# EAGLE design PIRT1280A1-12-breakout (EAGLE 9.6.2)
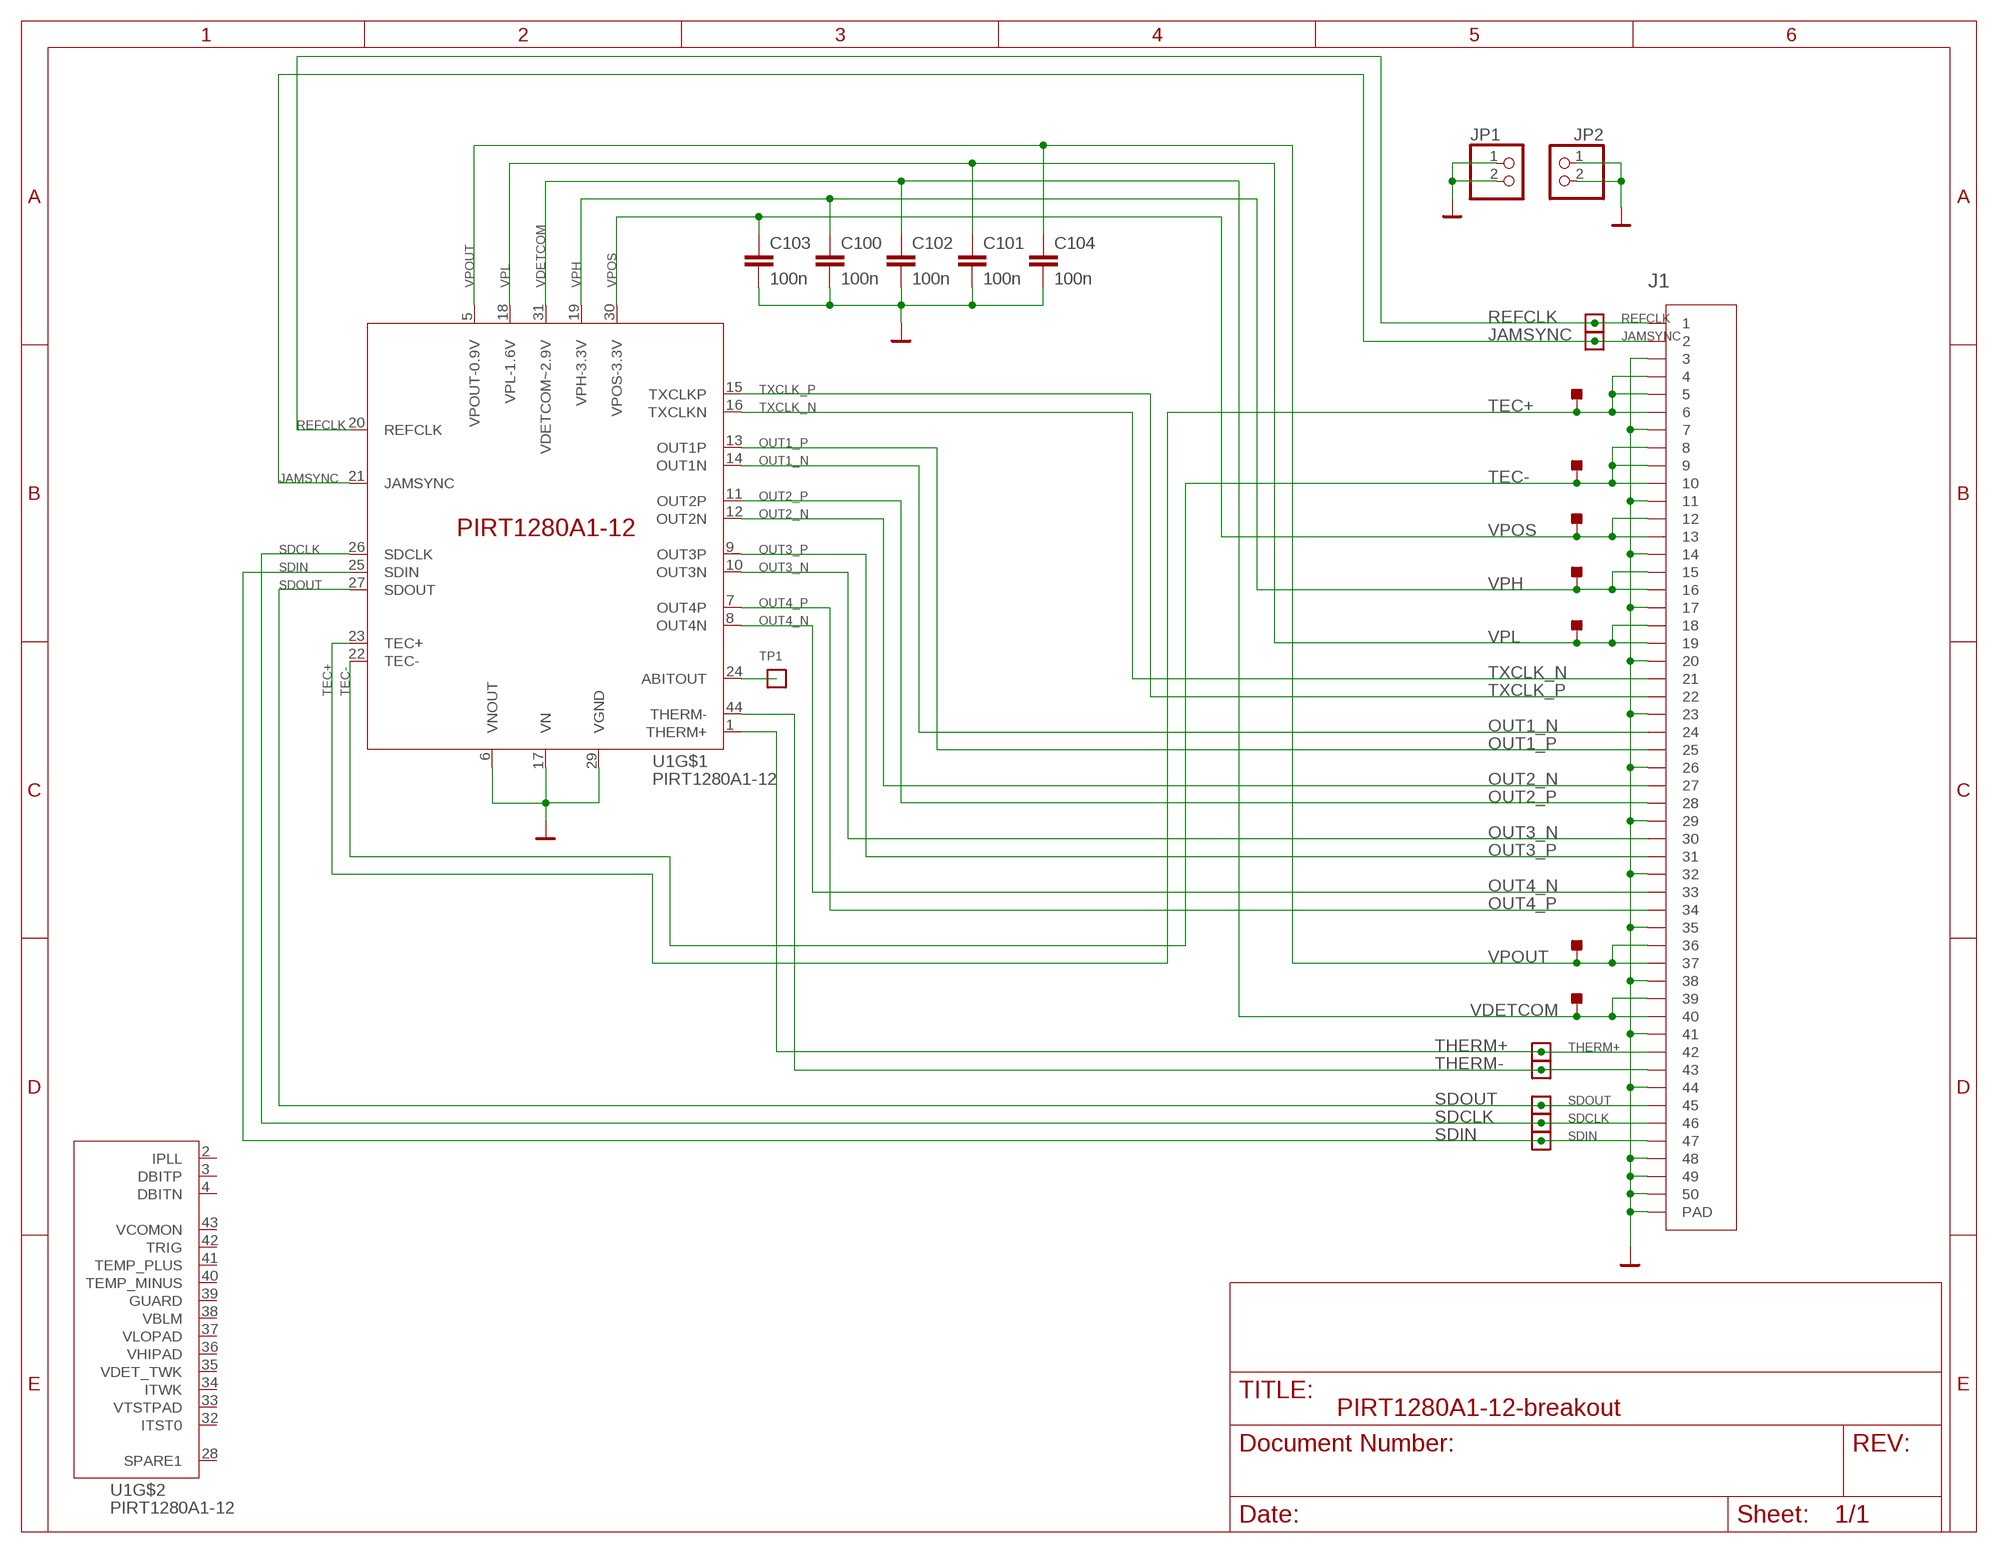
[diagram p0: schematic, sheet 1]

## Parts
C100  100n  C-EU0805-A  [.0805-A]
C101  100n  C-EU0805-A  [.0805-A]
C102  100n  C-EU0805-A  [.0805-A]
C103  100n  C-EU0805-A  [.0805-A]
C104  100n  C-EU0805-A  [.0805-A]
J1  5-1734592-0  [TE_5-1734592-0]
JAMSYNC  TEST-POINT-LARGE-SQUARE  [1X01]
JP1  PINHD-1X2  [1X02]
JP2  PINHD-1X2  [1X02]
REFCLK  TEST-POINT-LARGE-SQUARE  [1X01]
SDCLK  TEST-POINT-LARGE-SQUARE  [1X01]
SDIN  TEST-POINT-LARGE-SQUARE  [1X01]
SDOUT  TEST-POINT-LARGE-SQUARE  [1X01]
TEC+  TEST-POINT_SMD-SMD-10SN  [TESTPOINT_SMD-10SN]
TEC-  TEST-POINT_SMD-SMD-10SN  [TESTPOINT_SMD-10SN]
THERM+  TEST-POINT-LARGE-SQUARE  [1X01]
THERM-  TEST-POINT-LARGE-SQUARE  [1X01]
TP1  TEST-POINT-LARGE-SQUARE  [1X01]
U1  PIRT1280A1-12  [PIRT1280A1-12]
VDETCOM  TEST-POINT_SMD-SMD-10SN  [TESTPOINT_SMD-10SN]
VPH  TEST-POINT_SMD-SMD-10SN  [TESTPOINT_SMD-10SN]
VPL  TEST-POINT_SMD-SMD-10SN  [TESTPOINT_SMD-10SN]
VPOS  TEST-POINT_SMD-SMD-10SN  [TESTPOINT_SMD-10SN]
VPOUT  TEST-POINT_SMD-SMD-10SN  [TESTPOINT_SMD-10SN]

## Nets
ABITOUT: TP1.1 U1.24(ABITOUT)
GND: C100.2 C101.2 C102.2 C103.2 C104.2 J1.3 J1.7 J1.11 J1.14 J1.17 J1.20 J1.23 J1.26 J1.29 J1.32 J1.35 J1.38 J1.41 J1.44 J1.48 J1.49 J1.50 J1.S1(PAD) J1.S2(PAD) JP1.1 JP1.2 JP2.1 JP2.2 U1.6(VNOUT) U1.17(VN) U1.29(VGND)
JAMSYNC: J1.2 JAMSYNC.1 U1.21(JAMSYNC)
OUT1_N [diff-pair]: J1.24 U1.14(OUT1N)
OUT1_P [diff-pair]: J1.25 U1.13(OUT1P)
OUT2_N [diff-pair]: J1.27 U1.12(OUT2N)
OUT2_P [diff-pair]: J1.28 U1.11(OUT2P)
OUT3_N [diff-pair]: J1.30 U1.10(OUT3N)
OUT3_P [diff-pair]: J1.31 U1.9(OUT3P)
OUT4_N [diff-pair]: J1.33 U1.8(OUT4N)
OUT4_P [diff-pair]: J1.34 U1.7(OUT4P)
REFCLK: J1.1 REFCLK.1 U1.20(REFCLK)
SDCLK: J1.46 SDCLK.1 U1.26(SDCLK)
SDIN: J1.47 SDIN.1 U1.25(SDIN)
SDOUT: J1.45 SDOUT.1 U1.27(SDOUT)
TEC+: J1.4 J1.5 J1.6 TEC+.TP U1.23(TEC+)
TEC-: J1.8 J1.9 J1.10 TEC-.TP U1.22(TEC-)
THERM+: J1.42 THERM+.1 U1.1(THERM+)
THERM-: J1.43 THERM-.1 U1.44(THERM-)
TXCLK_N [diff-pair]: J1.21 U1.16(TXCLKN)
TXCLK_P [diff-pair]: J1.22 U1.15(TXCLKP)
VDETCOM: C102.1 J1.39 J1.40 U1.31(VDETCOM~2.9V) VDETCOM.TP
VPH: C100.1 J1.15 J1.16 U1.19(VPH-3.3V) VPH.TP
VPL: C101.1 J1.18 J1.19 U1.18(VPL-1.6V) VPL.TP
VPOS: C103.1 J1.12 J1.13 U1.30(VPOS-3.3V) VPOS.TP
VPOUT: C104.1 J1.36 J1.37 U1.5(VPOUT-0.9V) VPOUT.TP
Unconnected: U1.2(IPLL) U1.3(DBITP) U1.4(DBITN) U1.28(SPARE1) U1.32(ITST0) U1.33(VTSTPAD) U1.34(ITWK) U1.35(VDET_TWK) U1.36(VHIPAD) U1.37(VLOPAD) U1.38(VBLM) U1.39(GUARD) U1.40(TEMP_MINUS) U1.41(TEMP_PLUS) U1.42(TRIG) U1.43(VCOMON)

## Library data of the parts
C100-C104 = oresat-rcl:C-EU: CAPACITOR, European symbol
J1 = J-TEConnectivity-X-1734592-X:5-1734592-0
JAMSYNC REFCLK SDCLK SDIN SDOUT THERM+ THERM- TP1 = oresat-misc:TEST-POINT-LARGE-SQUARE
JP1 JP2 = pinhead:PINHD-1X2: PIN HEADER
TEC+ TEC- VDETCOM VPH VPL VPOS VPOUT = oresat-misc:TEST-POINT_SMD: TEST POINT PAD; BOM: EXCLUDE
U1 = PIRT1280A1-12:PIRT1280A1-12: Footprint for the Princeton PIRT1280A1-12 SWIR Sensor

## Net classes
1 diff-pair: width 0.381 mm, clearance 0.508 mm to class 0, clearance 0.254 mm

## Board
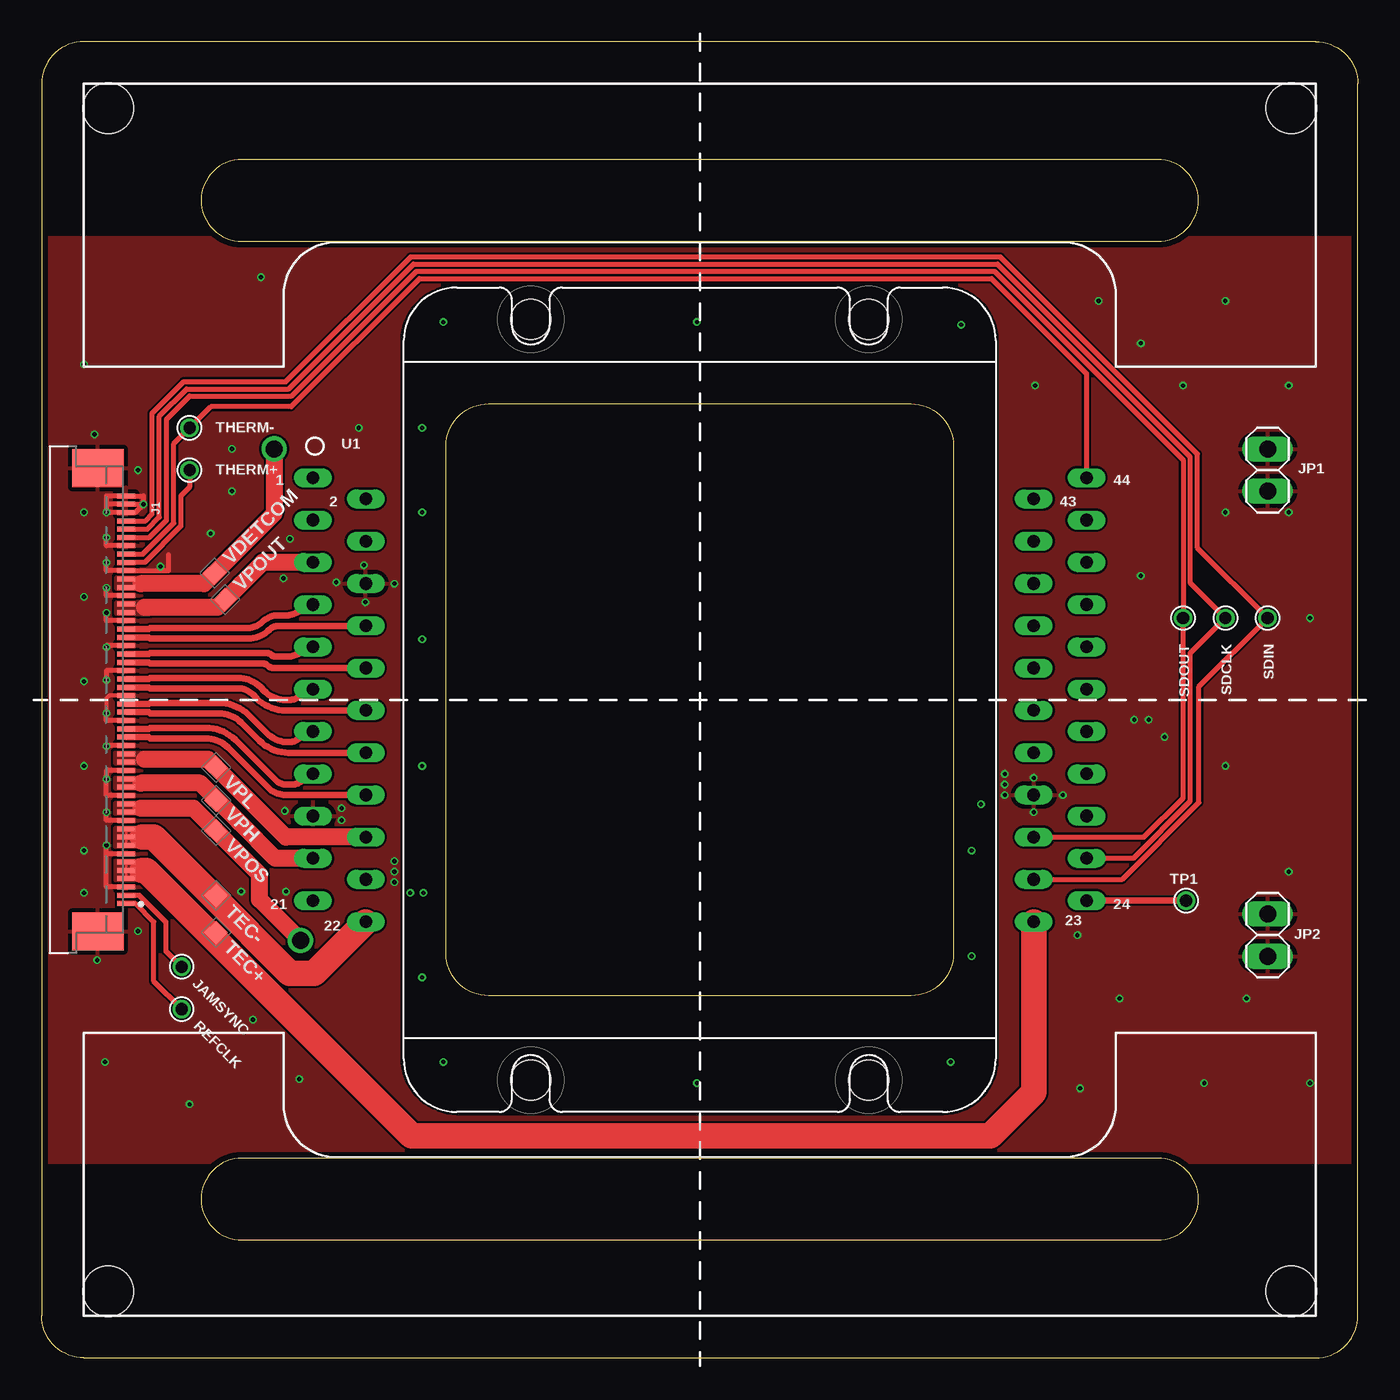
[diagram p1: board, top side]
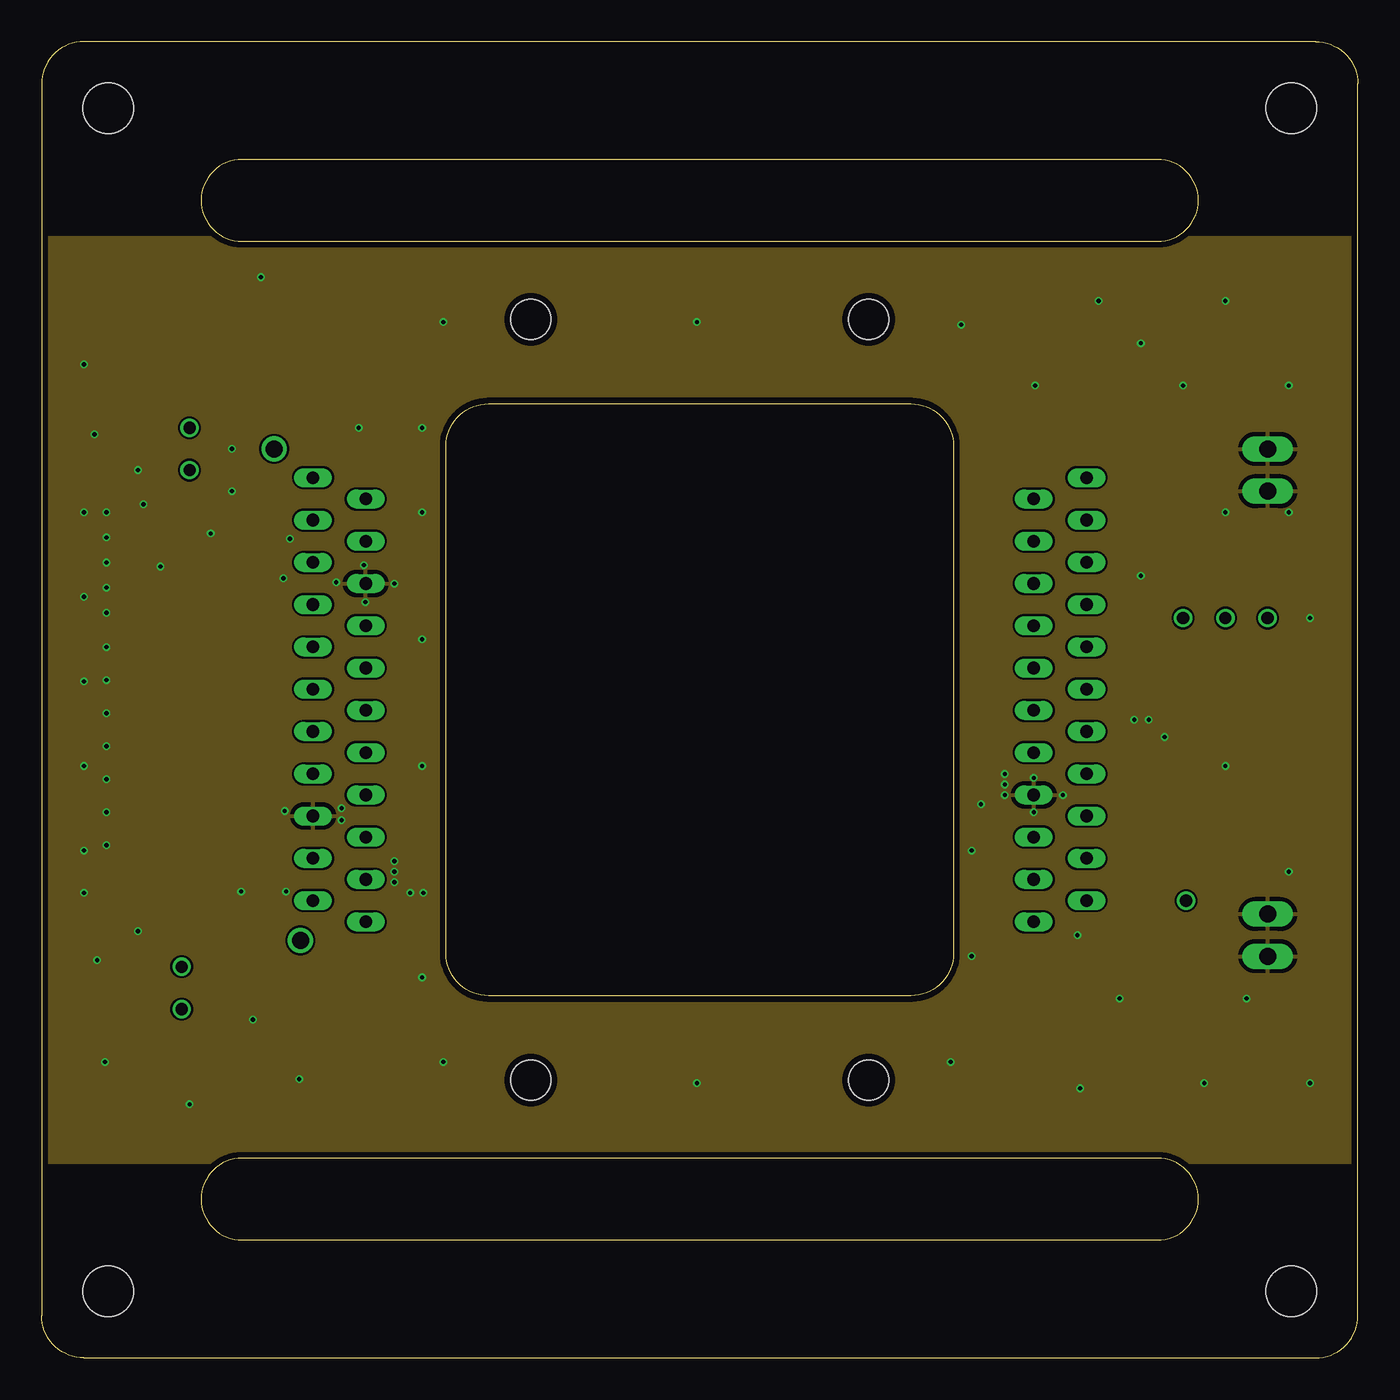
[diagram p2: board, inner layer Route2]
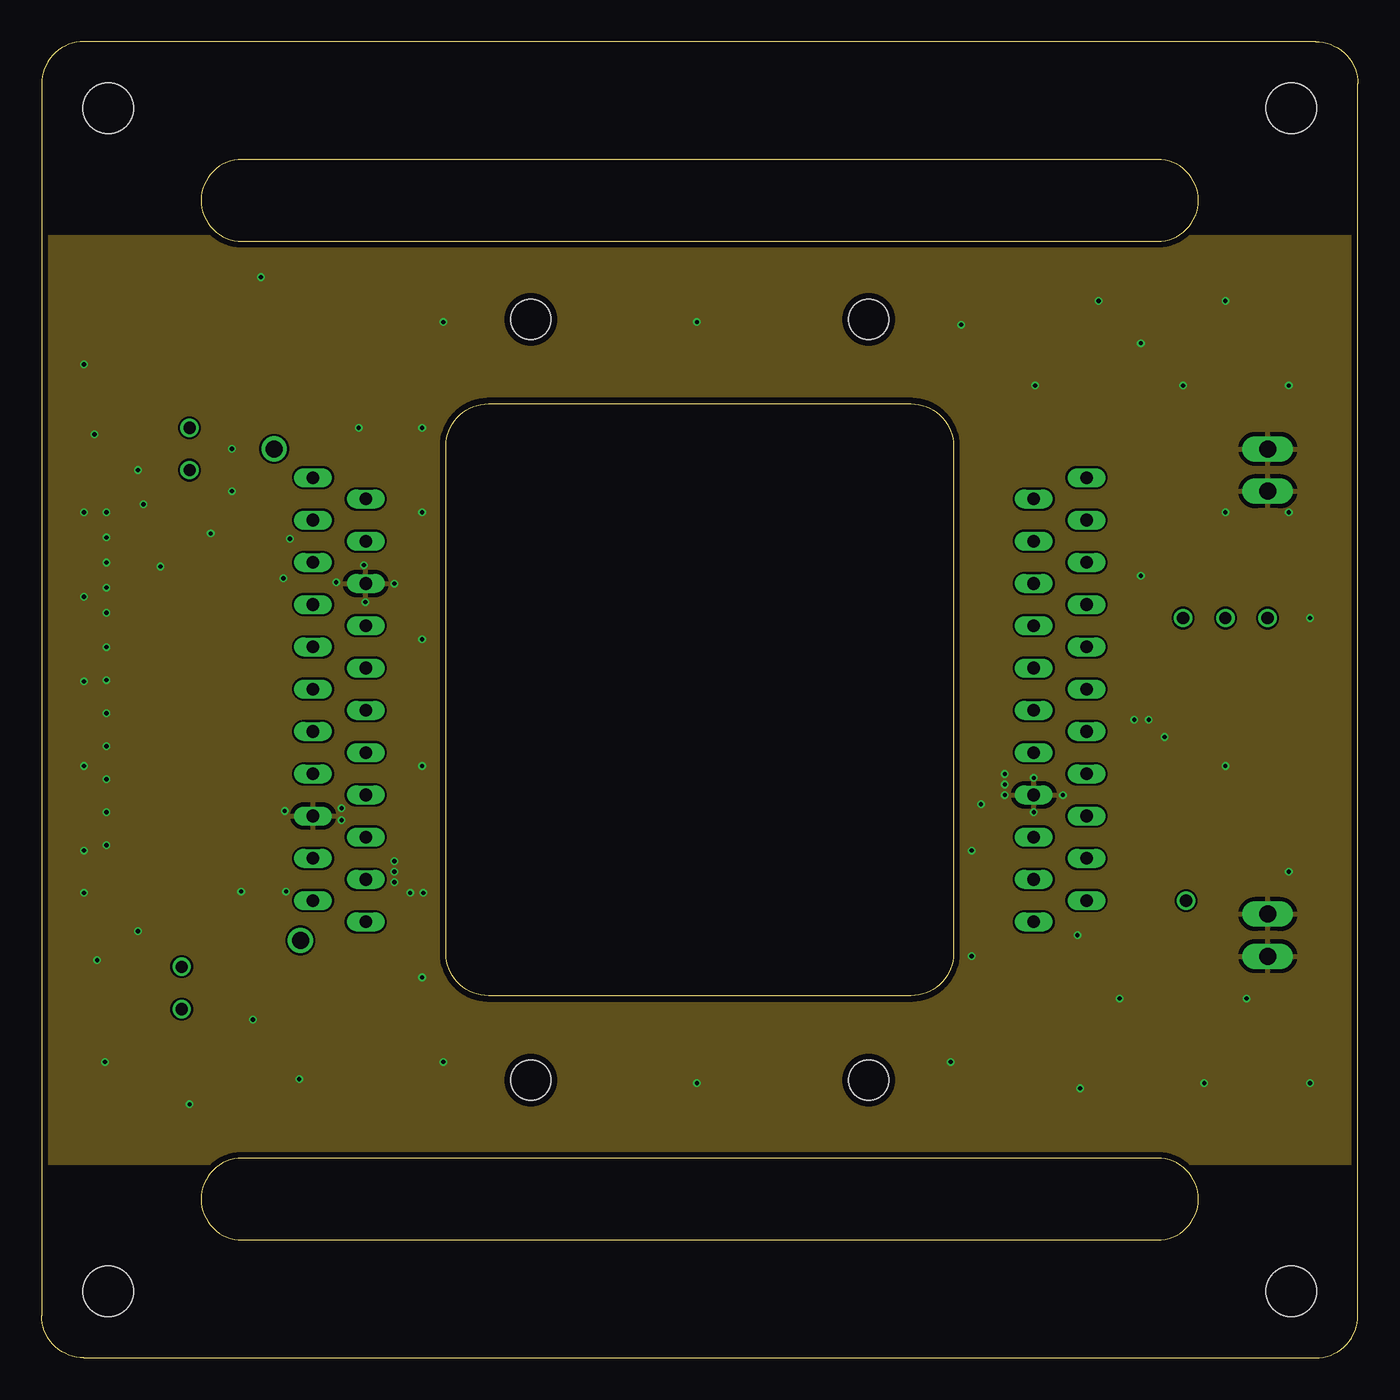
[diagram p3: board, inner layer Route15]
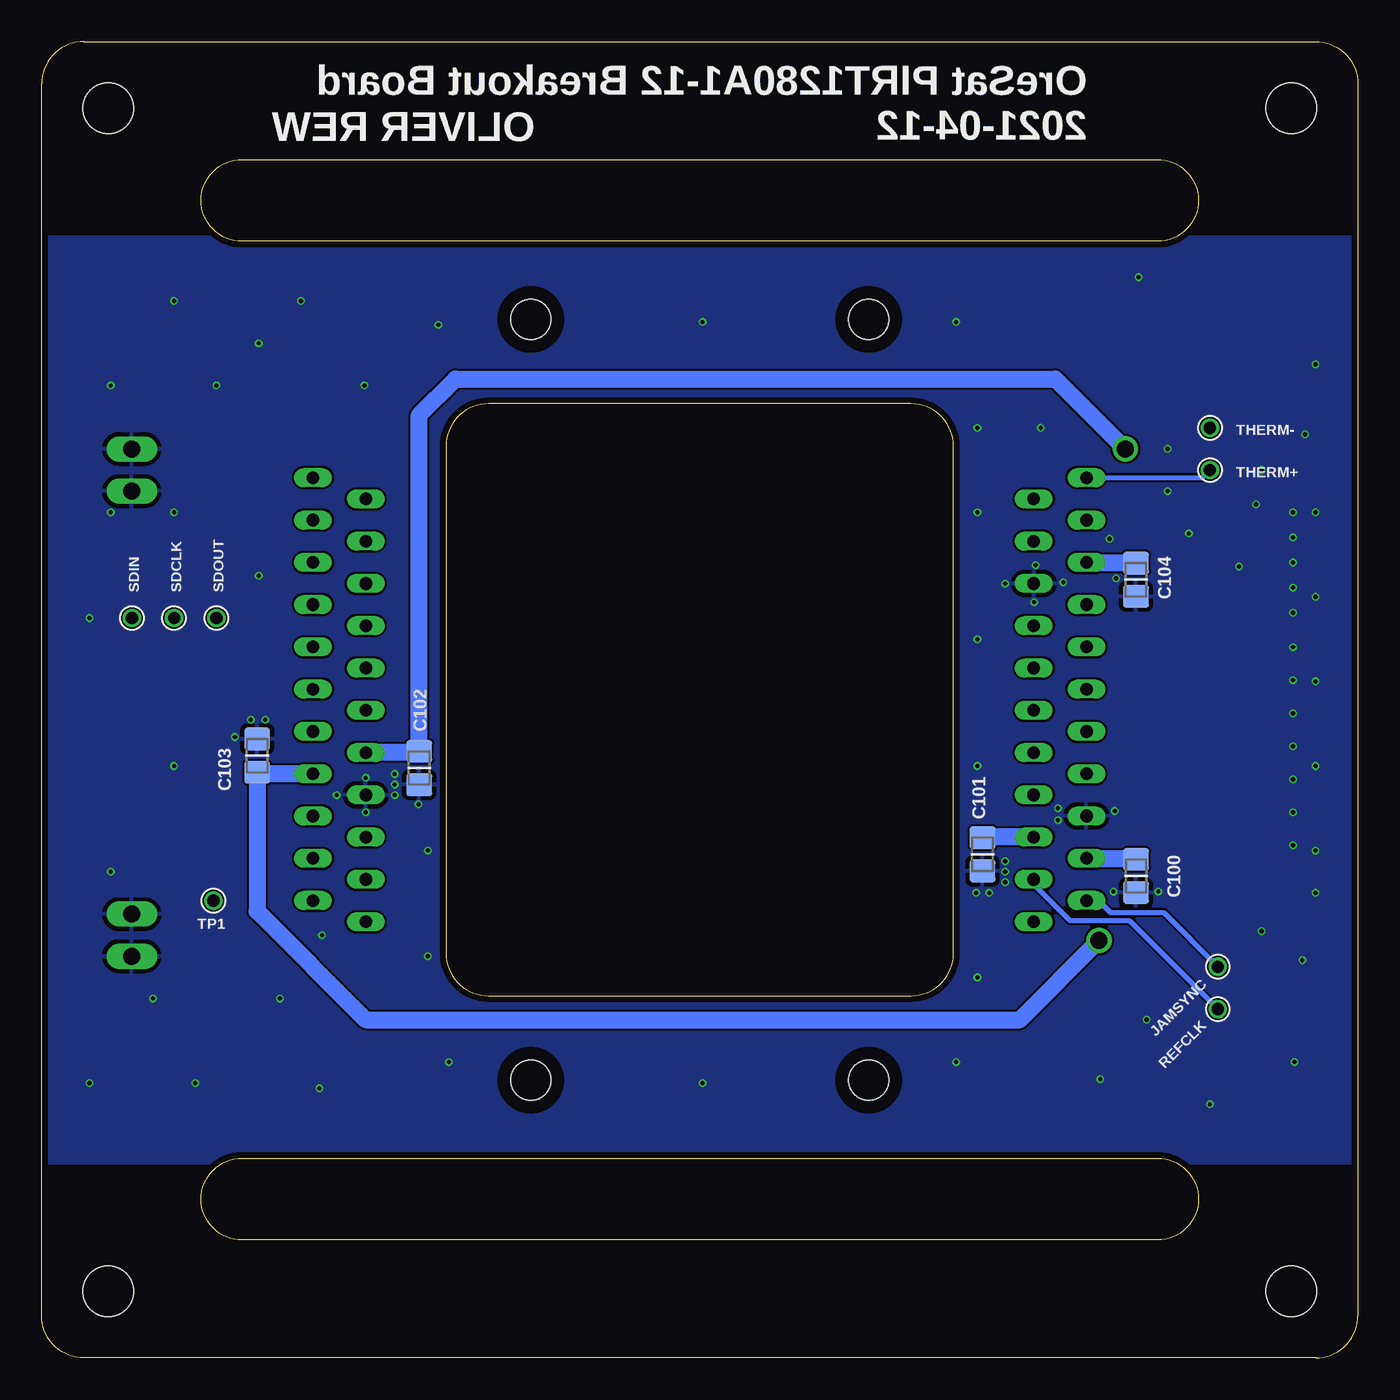
[diagram p4: board, bottom side, seen from below]

Size 79.08 x 79.08 mm. Coordinates in mm from the lower left corner, seen from the top.
Outline: 2.54,0 76.54,0 arc90 79.08,2.54 79.08,76.54 arc90 76.54,79.08 2.54,79.08 arc90 0,76.54 0,2.54 arc90 2.54,0
Outline: 12.04,72 arc180 12.04,67.08 67.04,67.08 arc180 67.04,72 12.04,72
Outline: 12.04,12 arc180 12.04,7.08 67.04,7.08 arc180 67.04,12 12.04,12
Copper layers (1*2*15*16): Top 0.035559375mm / dielectric 0.17018125mm / Route2 0.01778125mm / dielectric 47mil / Route15 0.01778125mm / dielectric 0.17018125mm / Bottom 0.035559375mm
Design rules "oshpark-4layer-tented": minimum track width 5mil, minimum drill 10mil, track to track 5mil, track to pad 5mil, pad to pad 5mil, via to via 5mil, smd to smd 5mil, copper to edge 15mil, drill to drill 6mil, minimum pad ring 4mil, minimum via ring 4mil, stop-mask expansion 2.5mil, vias tented up to drill 20mil, thermal gap 10mil
Holes 3 mm at 4,75.08 75.08,75.08 4,4 75.08,4
tRestrict: area 21.7,14.8 to 57.3,64.3

### Footprints (pad centres in the part's own frame; a part is rotated, then mirrored left to right if it is on the bottom)
.0805-A = smd 1.35 x 1.55: 1 -1,0; 2 1,0
TE_5-1734592-0 = smd 0.3 x 1.1: 1 -12.25,0; 2 -11.75,0; 3 -11.25,0; 4 -10.75,0; 5 -10.25,0; 6 -9.75,0; 7 -9.25,0; 8 -8.75,0; 9 -8.25,0; 10 -7.75,0; 11 -7.25,0; 12 -6.75,0; 13 -6.25,0; 14 -5.75,0; 15 -5.25,0; 16 -4.75,0; 17 -4.25,0; 18 -3.75,0; 19 -3.25,0; 20 -2.75,0; 21 -2.25,0; 22 -1.75,0; 23 -1.25,0; 24 -0.75,0; 25 -0.25,0; 26 0.25,0; 27 0.75,0; 28 1.25,0; 29 1.75,0; 30 2.25,0; 31 2.75,0; 32 3.25,0; 33 3.75,0; 34 4.25,0; 35 4.75,0; 36 5.25,0; 37 5.75,0; 38 6.25,0; 39 6.75,0; 40 7.25,0; 41 7.75,0; 42 8.25,0; 43 8.75,0; 44 9.25,0; 45 9.75,0; 46 10.25,0; 47 10.75,0; 48 11.25,0; 49 11.75,0; 50 12.25,0 | smd 2.3 x 3.1: S1 13.92,1.7; S2 -13.92,1.7
1X01 = drill 0.737 pad 1.1: 1 0,0
1X02 = drill 1.016 long: 1 -1.27,0; 2 1.27,0
TESTPOINT_SMD-10SN = smd 1 x 1: TP 0,0
PIRT1280A1-12 = drill 0.762 long: 1 -23.241,13.335; 2 -20.066,12.065; 3 -23.241,10.795; 4 -20.066,9.525; 5 -23.241,8.255; 6 -20.066,6.985; 7 -23.241,5.715; 8 -20.066,4.445; 9 -23.241,3.175; 10 -20.066,1.905; 11 -23.241,0.635; 12 -20.066,-0.635; 13 -23.241,-1.905; 14 -20.066,-3.175; 15 -23.241,-4.445; 16 -20.066,-5.715; 17 -23.241,-6.985; 18 -20.066,-8.255; 19 -23.241,-9.525; 20 -20.066,-10.795; 21 -23.241,-12.065; 22 -20.066,-13.335; 23 20.066,-13.335; 24 23.241,-12.065; 25 20.066,-10.795; 26 23.241,-9.525; 27 20.066,-8.255; 28 23.241,-6.985; 29 20.066,-5.715; 30 23.241,-4.445; 31 20.066,-3.175; 32 23.241,-1.905; 33 20.066,-0.635; 34 23.241,0.635; 35 20.066,1.905; 36 23.241,3.175; 37 20.066,4.445; 38 23.241,5.715; 39 20.066,6.985; 40 23.241,8.255; 41 20.066,9.525; 42 23.241,10.795; 43 20.066,12.065; 44 23.241,13.335 | hole 2.4: -10.16,22.86; 10.16,22.86; 10.16,-22.86; -10.16,-22.86

### Placement (x,y rotation side)
C100  13.33,28.96 270 bottom
C101  22.55,30.25 270 bottom
C102  56.39,35.44 270 bottom
C103  66.13,36.18 90 bottom
C104  13.34,46.75 270 bottom
J1  5.08,39.54 90 top
JAMSYNC  8.41,23.5 0 top
JP1  73.66,53.34 90 top
JP2  73.66,25.4 90 top
REFCLK  8.41,20.95 0 top
SDCLK  71.12,44.45 270 top
SDIN  73.66,44.45 270 top
SDOUT  68.58,44.45 270 top
TEC+  10.48,25.56 45 top
TEC-  10.48,27.78 45 top
THERM+  8.89,53.34 0 top
THERM-  8.89,55.88 0 top
TP1  68.75,27.48 0 top
U1  39.54,39.54 0 top
VDETCOM  10.4,47.15 45 top
VPH  10.48,33.5 45 top
VPL  10.48,35.48 45 top
VPOS  10.48,31.67 45 top
VPOUT  11.03,45.56 45 top

### Tracks (layer width: path | path; a pad name or v marks a point on that pad's centre or on a via)
ABITOUT
  Top 0.381: U1.24 TP1.1
GND  (via drill 0.25)
  Top 0.254: J1.26 4.07,39.79 3.89,39.61 v3.89,38.73
  Top 0.305: v3.89,47.78 3.89,47.29 J1.41 5.17,47.29 5.17,47.3 7.62,47.3 7.62,48.26 | J1.44 3.89,48.79 v3.89,49.29 | J1.38 3.89,45.79 v3.89,46.28 | J1.35 3.89,44.29 v3.89,44.77 | J1.32 3.89,42.79 v3.89,42.7 | J1.29 3.89,41.29 v3.89,40.72 | J1.23 3.89,38.29 v3.89,38.73 | J1.20 3.89,36.79 v3.89,36.75 | J1.17 3.89,35.29 v3.89,34.77 3.89,33.79 J1.14 | J1.11 3.89,32.29 v3.89,32.78 | J1.7 3.89,30.29 | 3.89,30.29 v3.89,30.8 | J1.3 3.89,28.29 3.89,30.29 | 3.89,51.29 J1.49 v6.11,51.29 v6.11,51.28 | 3.89,51.29 v3.89,50.8 v3.89,50.79 J1.48 5.63,50.79 v6.11,51.28 | 3.89,51.29 3.89,51.79 J1.50 6.11,51.79 v6.11,51.28
  other vias: 11.99,28.02 14.68,28.02 22.15,27.94 14.53,46.83 17.7,46.59 19.37,47.62 19.45,45.4 21.19,46.51 22.94,27.94 21.19,29.21 65.64,38.34 66.52,38.34 67.47,37.31 61.36,33.81 59.61,34.85 57.86,33.81 59.61,32.78 5.79,53.34 3.17,55.48 5.79,25.64 3.33,23.89 56.44,33.26 14.61,32.86 18.02,33.02 18.02,32.31 7.14,47.55 10.16,49.53 11.43,52.07 11.43,54.61 19.05,55.88 2.54,59.69 12.7,20.32 3.81,17.78 64.77,21.59 62.23,25.4 55.88,24.13 22.86,22.86 39.37,62.23 59.69,58.42 66.04,46.99 24.13,62.23 39.37,16.51 24.13,17.78 54.61,17.78 14.92,49.21 55.24,62.07 68.58,58.42 66.04,60.96 63.5,63.5 13.18,64.93 15.48,16.75 71.12,50.8 71.12,35.56 62.39,16.19 22.86,35.56 22.86,43.18 22.86,50.8 22.86,55.88 55.88,30.48 2.54,30.48 2.54,35.56 2.54,40.64 2.54,45.72 2.54,50.8 2.54,27.94 69.85,16.51 72.39,21.59 74.93,29.21 76.2,44.45 74.93,50.8 74.93,58.42 71.12,63.5 76.2,16.51 8.89,15.24 21.19,29.84 21.19,28.57 57.86,34.45 57.86,35.08
  pour Bottom (rank 2): -1.27,11.75 -1.27,67.31 80.01,67.31 80.01,11.75
  pour Top (rank 2): -2.54,11.75 -2.54,67.31 81.28,67.31 81.28,11.75
  pour Route2: -3.81,11.75 -3.81,67.31 82.55,67.31 82.55,11.75
  pour Route15: -5.08,11.75 83.82,11.75 83.82,67.31 -5.08,67.31
JAMSYNC
  Top 0.305: JAMSYNC.1 7.46,24.45 7.46,26.19 5.87,27.79 J1.2
  Bottom 0.305: U1.21 15.59,27.48 14.86,26.75 11.67,26.75 JAMSYNC.1
OUT1_N
  Top 0.381: J1.24 6.44,38.79 6.51,38.72 10.65,38.72 arc-45 12,38.16 13.08,37.08 arc45 14.84,36.35 19.45,36.35 arc45 U1.14
OUT1_P
  Top 0.381: J1.25 6.44,39.29 6.51,39.36 10.65,39.36 arc-45 12.45,38.61 13.53,37.53 arc45 14.84,36.99 arc45 15.52,37.27 15.83,37.58 arc-45 15.97,37.63 U1.13
OUT2_N
  Top 0.381: J1.27 6.44,40.29 6.51,40.22 11.79,40.22 arc-45 12.7,39.85 12.92,39.62 arc45 14.68,38.89 19.46,38.89 U1.12
OUT2_P
  Top 0.381: J1.28 6.44,40.79 6.51,40.86 11.79,40.86 arc-45 13.15,40.3 13.37,40.07 arc45 14.68,39.53 14.87,39.53 arc45 15.64,39.85 15.73,39.94 arc-45 U1.11
OUT3_N
  Top 0.381: J1.30 6.44,41.79 6.51,41.72 13.26,41.72 arc-45 13.57,41.59 arc45 13.93,41.45 U1.10
OUT3_P
  Top 0.381: J1.31 6.44,42.29 6.51,42.36 13.5,42.36 arc-45 13.81,42.23 arc45 14,42.15 14.87,42.15 arc45 15.64,42.47 arc-45 16.24,42.72 U1.9
OUT4_N
  Top 0.381: J1.33 6.44,43.29 6.51,43.22 12.4,43.22 arc45 13.71,43.76 arc-45 14.21,43.97 19.45,43.97 arc45 U1.8
OUT4_P
  Top 0.381: J1.34 6.44,43.79 6.51,43.86 12.4,43.86 arc45 13.26,44.21 arc-45 14.21,44.61 14.68,44.61 arc45 15.64,45.01 arc-45 16.24,45.26 U1.7
REFCLK
  Top 0.305: REFCLK.1 6.75,22.62 6.75,26.19 5.65,27.29 J1.1
  Bottom 0.305: U1.20 19.47,28.44 17.3,26.27 13.73,26.27 REFCLK.1
SDCLK
  Top 0.305: J1.46 6.36,49.79 7.07,50.5 7.07,56.58 8.71,58.22 14.85,58.22 22.34,65.71 57.43,65.71 69.01,54.13 69.01,46.56 SDCLK.1 69.01,42.34 69.01,33.45 65.58,30.02 U1.26
SDIN
  Top 0.305: J1.47 6.25,50.29 6.64,50.68 6.64,56.76 8.53,58.65 14.67,58.65 22.16,66.14 57.61,66.14 69.44,54.31 69.44,48.67 SDIN.1 69.53,40.32 69.53,33.36 64.92,28.75 U1.25
SDOUT
  Top 0.305: J1.45 6.47,49.29 7.51,50.32 7.51,56.4 8.89,57.78 15.03,57.78 22.52,65.28 57.25,65.28 68.58,53.95 SDOUT.1 68.58,33.63 66.23,31.29 U1.27
TEC+
  Top 0.152: TEC+.TP 10.32,25.4 10.16,25.4 | J1.6 J1.5 | J1.5 J1.4 | J1.5 6.27,29.29
  Top 1.524: U1.23 59.61,15.95 56.99,13.34 22.23,13.34 10.16,25.4 6.27,29.29 6.04,29.29
  pour Top (no thermals): 4.45,28.73 6.19,28.73 6.19,29.84 4.45,29.84
TEC-
  Top 0.152: TEC-.TP 10.23,27.78 10.12,27.9 | J1.10 J1.9 | J1.9 J1.8 | J1.9 6.72,31.29
  Top 0.305: 10.24,28.02 TEC-.TP
  Top 1.524: U1.22 16.38,23.11 14.9,23.11 10.12,27.9 6.72,31.29 6.04,31.29
  pour Top (no thermals): 4.45,31.83 6.19,31.83 6.19,30.72 4.45,30.72
THERM+
  Top 0.305: THERM+.1 8.89,52.31 8.37,51.79 8.37,49.97 6.19,47.79 J1.42
  Bottom 0.305: U1.1 9.36,52.88 THERM+.1
THERM-
  Top 0.305: J1.43 6.08,48.29 7.94,50.15 7.94,54.93 THERM-.1 10.16,57.15 15,57.15 22.7,64.85 57.07,64.85 62.78,59.14 U1.44
TXCLK_N
  Top 0.381: J1.21 6.44,37.29 6.51,37.22 9.85,37.22 arc-45 11.2,36.66 13.6,34.26 arc45 14.68,33.81 19.45,33.81 arc45 U1.16
TXCLK_P
  Top 0.381: J1.22 6.44,37.79 6.51,37.86 9.85,37.86 arc-45 11.65,37.11 14.05,34.71 arc45 14.68,34.45 15.06,34.45 arc45 15.64,34.69 15.87,34.91 arc-45 U1.15
VDETCOM  (via drill 1.02)
  Top 0.305: VDETCOM.TP 12.11,48.85
  Top 1.016: v13.97,54.61 13.97,50.72 12.11,48.85 9.76,46.51 5.95,46.51
  Bottom 1.016: U1.31 56.49,36.37 C102.1 56.39,56.64 54.21,58.82 18.18,58.82 v13.97,54.61
  pour Top (no thermals): 4.52,46.2 4.52,46.91 6.19,46.91 6.19,46.2
VPH
  Top 0.305: VPH.TP 10.56,33.5 11.87,32.19
  Top 1.016: U1.19 14.04,30.02 11.87,32.19 9.53,34.53 5.95,34.53
  Bottom 1.016: U1.19 13.39,30.02 C100.1
  pour Top (no thermals): 4.45,34.21 4.45,34.85 6.27,34.85 6.27,34.21
VPL
  Top 0.305: VPL.TP 11.55,34.41
  Top 1.016: U1.18 14.67,31.29 11.55,34.41 10,35.96 6.19,35.96
  Bottom 1.016: U1.18 22.52,31.29 C101.1
  pour Top (no thermals): 4.45,35.72 4.45,36.35 6.19,36.35 6.19,35.72
VPOS  (via drill 1.02)
  Top 0.305: VPOS.TP 9.64,32.5
  Top 1.016: v15.56,25.08 13.1,27.54 13.1,29.05 9.64,32.5 9.13,33.02 5.95,33.02
  Bottom 1.016: U1.30 66.04,35.09 C103.1 66.13,26.84 59.61,20.32 20.32,20.32 v15.56,25.08
  pour Top (no thermals): 4.45,32.7 4.45,33.34 6.19,33.34 6.19,32.7
VPOUT
  Top 0.305: VPOUT.TP 11.95,46.47
  Top 1.016: U1.5 13.27,47.8 11.95,46.47 10.56,45.09 6.19,45.09
  Bottom 1.016: U1.5 13.38,47.8 C104.1
  pour Top (no thermals): 4.52,44.69 4.52,45.4 6.43,45.4 6.43,44.69

### Text on the board
bPlace: OreSat PIRT1280A1-12 Breakout Board | 2021-04-12 | OLIVER REW
tDocu: 50 Pos FFC Cable: / 0152660535